# EAGLE design solenoid_final (EAGLE 9.1.3)
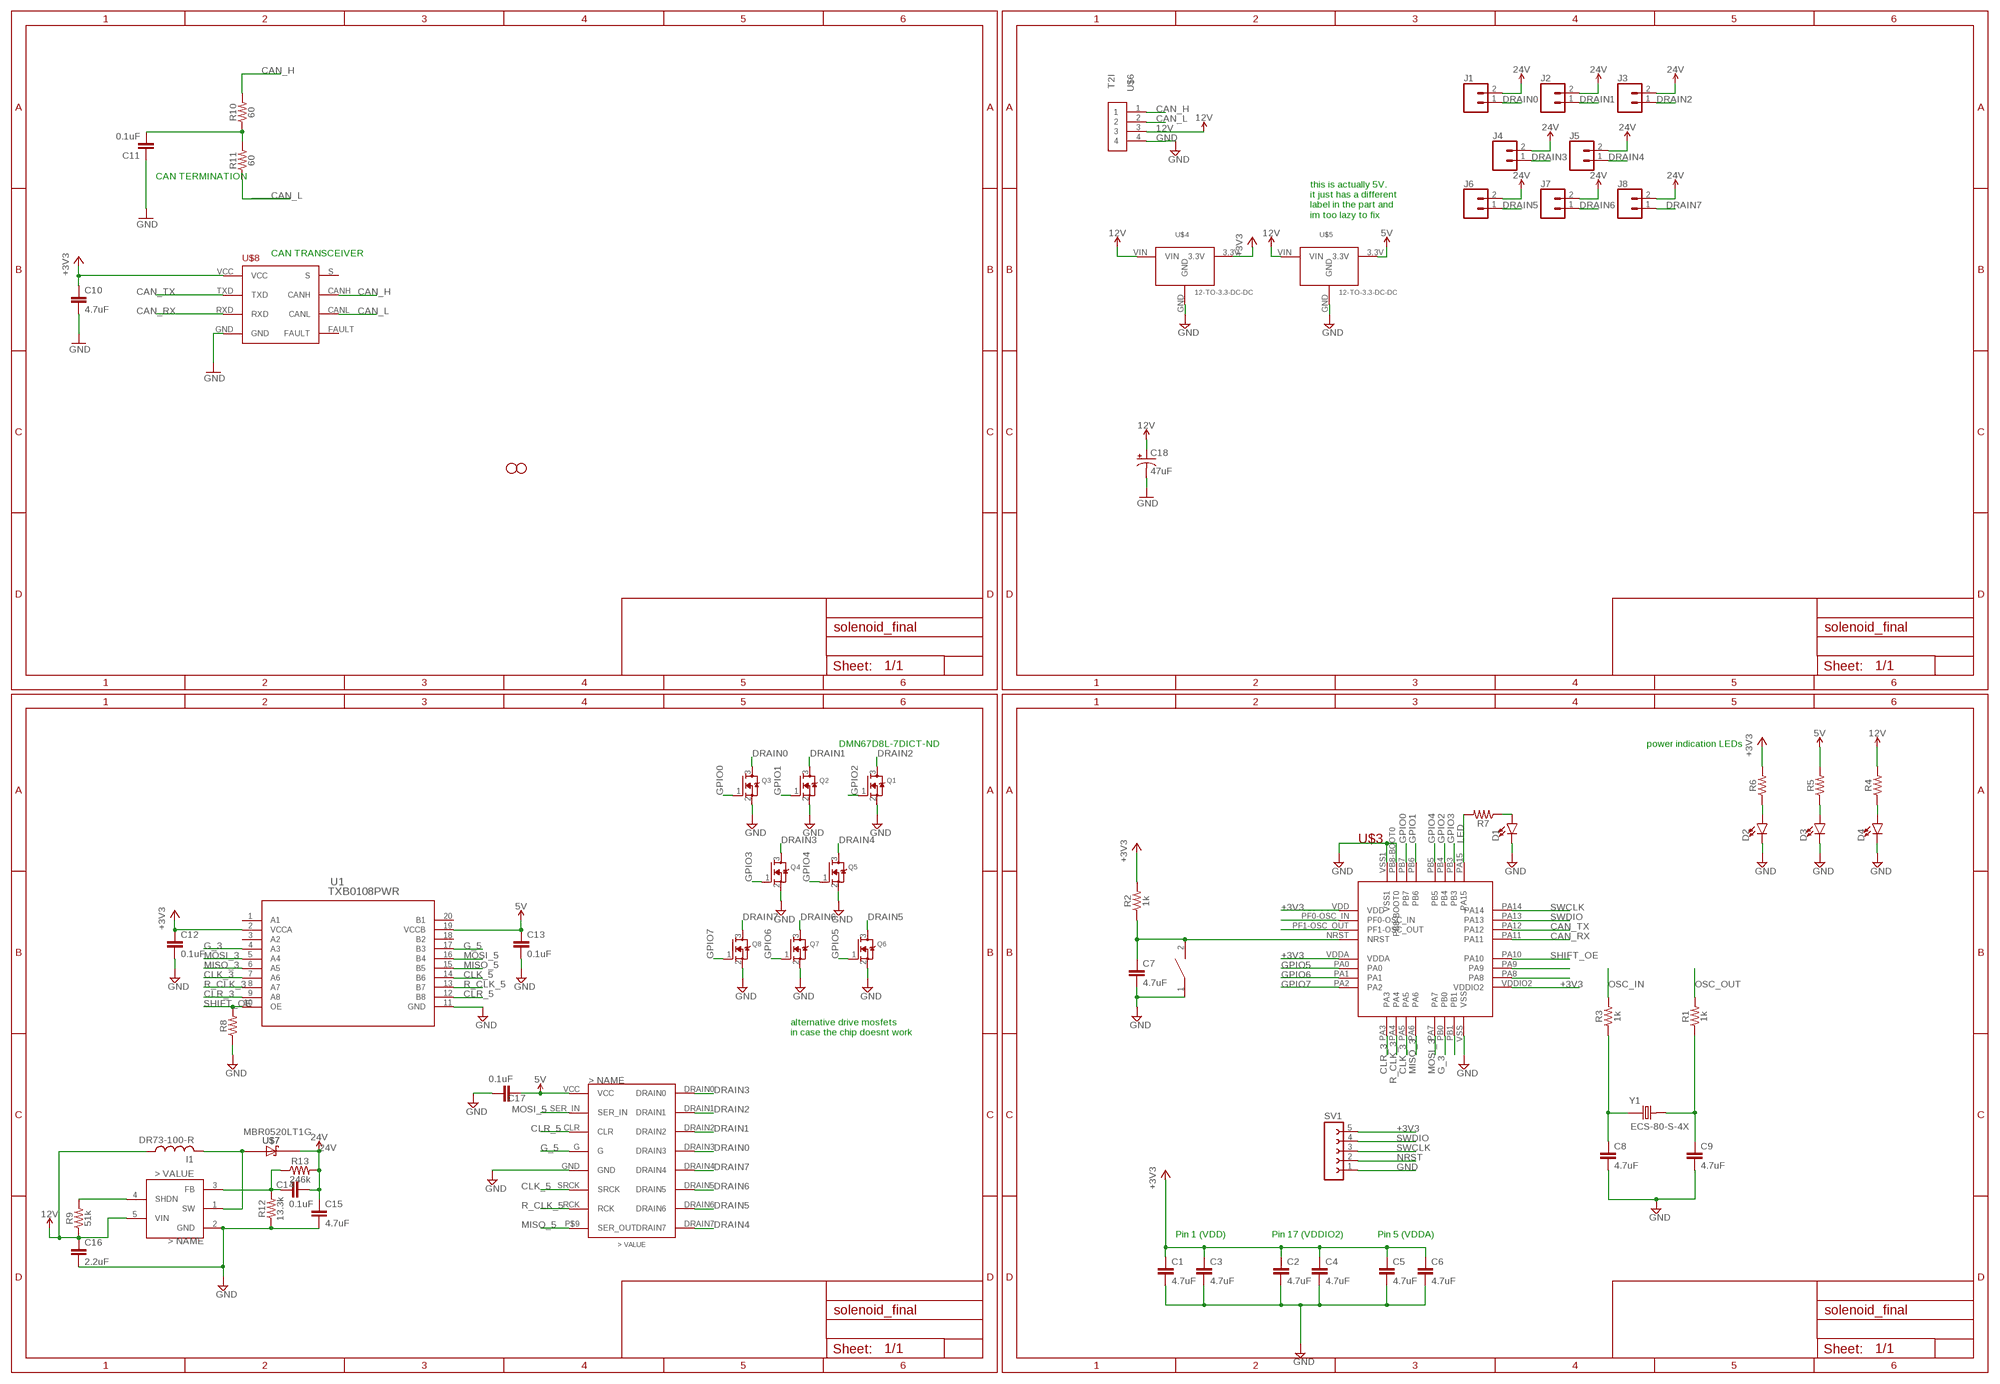
[diagram p0: schematic, sheet 1]

## Parts
C1  4.7uF  4.7UF0603  [0603]
C2  4.7uF  4.7UF0603  [0603]
C3  4.7uF  4.7UF0603  [0603]
C4  4.7uF  4.7UF0603  [0603]
C5  4.7uF  4.7UF0603  [0603]
C6  4.7uF  4.7UF0603  [0603]
C7  4.7uF  4.7UF0603  [0603]
C8  4.7uF  4.7UF0603  [0603]
C9  4.7uF  4.7UF0603  [0603]
C10  4.7uF  4.7UF0603  [0603]
C11  0.1uF  0.1UF-0603-25V-(+80/-20%)  [0603]
C12  0.1uF  0.1UF-0603-25V-5%  [0603]
C13  0.1uF  0.1UF-0603-25V-5%  [0603]
C14  0.1uF  0.1UF-0603-25V-5%  [0603]
C15  4.7uF  0.1UF-0603-25V-5%  [0603]
C16  2.2uF  0.1UF-0603-25V-5%  [0603]
C17  0.1uF  0.1UF-0603-25V-5%  [0603]
C18  47uF  47UF-POLAR-PANASONIC_D-35V-20%  [PANASONIC_D]
D1  LED0603  [LED-0603]
D2  LED0603  [LED-0603]
D3  LED0603  [LED-0603]
D4  LED0603  [LED-0603]
H1  STAND-OFF  [STAND-OFF]
H2  STAND-OFF  [STAND-OFF]
I1  DR73-100-R  [DR73-100-R]
J1  CONN_02  [1X02]
J2  CONN_02  [1X02]
J3  CONN_02  [1X02]
J4  CONN_02  [1X02]
J5  CONN_02  [1X02]
J6  CONN_02  [1X02]
J7  CONN_02  [1X02]
J8  CONN_02  [1X02]
Q1  MOSFET-NWIDE  [SOT23-WIDE]
Q2  MOSFET-NWIDE  [SOT23-WIDE]
Q3  MOSFET-NWIDE  [SOT23-WIDE]
Q4  MOSFET-NWIDE  [SOT23-WIDE]
Q5  MOSFET-NWIDE  [SOT23-WIDE]
Q6  MOSFET-NWIDE  [SOT23-WIDE]
Q7  MOSFET-NWIDE  [SOT23-WIDE]
Q8  MOSFET-NWIDE  [SOT23-WIDE]
R1  1k  1KOHM-0603-1/10W-1%  [0603]
R2  1k  1KOHM-0603-1/10W-1%  [0603]
R3  1k  1KOHM-0603-1/10W-1%  [0603]
R4  RESISTOR0603  [0603]
R5  RESISTOR0603  [0603]
R6  RESISTOR0603  [0603]
R7  RESISTOR0603  [0603]
R8  RESISTOR0603  [0603]
R9  51k  RESISTOR0603  [0603]
R10  60  1KOHM-0603-1/10W-1%  [0603]
R11  60  1KOHM-0603-1/10W-1%  [0603]
R12  13.3k  RESISTOR0603  [0603]
R13  246k  RESISTOR0603  [0603]
RESET  SWITCH  [SW_2512]
SV1  FE05-1  [FE05-1]
U1  TXB0108PWR  [PW20]
U$1  SHIFT_REGISTER  [SHIFT_REGISTER]
U$2  LM27313  [SOT95P300X145-5]
U$3  STM32F042K6T6  [STM32F042K6T6]
U$4  12-TO-3.3-DC-DC  [MURATA-DCDC]
U$5  12-TO-3.3-DC-DC  [MURATA-DCDC]
U$6  T2I  [T2I]
U$7  MBR0520LT1G  [SOD3716X135]
U$8  TCAN337D  [TCAN337D]
Y1  ECS-80-S-4X  [XTAL_ECS-80-S-4X]

## Nets
5V: C13.1 C17.1 R5.2 U1.19(VCCB) U$1.VCC U$5.3.3V
12V: C16.1 C18.+ I1.1 R4.2 R9.1 U$2.5(VIN) U$4.VIN U$5.VIN U$6.3
24V: C14.2 C15.1 J1.2 J2.2 J3.2 J4.2 J5.2 J6.2 J7.2 J8.2 R13.2 U$7.2(C)
+3V3: C1.1 C2.1 C3.1 C4.1 C5.1 C6.1 C10.1 C12.1 R2.2 R6.2 SV1.5 U1.2(VCCA) U$3.VDD U$3.VDDA U$3.VDDIO2 U$4.3.3V U$8.VCC
CAN_H: R10.2 U$6.1 U$8.CANH
CAN_L: R11.1 U$6.2 U$8.CANL
CAN_RX: U$3.PA11 U$8.RXD
CAN_TX: U$3.PA12 U$8.TXD
CLK_3: U1.7(A6) U$3.PA5
CLK_5: U1.14(B6) U$1.SRCK
CLR_3: U1.9(A8) U$3.PA3
CLR_5: U1.12(B8) U$1.CLR
DRAIN0: J1.1 Q3.3(D) U$1.DRAIN3
DRAIN1: J2.1 Q2.3(D) U$1.DRAIN2
DRAIN2: J3.1 Q1.3(D) U$1.DRAIN1
DRAIN3: J4.1 Q4.3(D) U$1.DRAIN0
DRAIN4: J5.1 Q5.3(D) U$1.DRAIN7
DRAIN5: J6.1 Q6.3(D) U$1.DRAIN6
DRAIN6: J7.1 Q7.3(D) U$1.DRAIN5
DRAIN7: J8.1 Q8.3(D) U$1.DRAIN4
G_3: U1.4(A3) U$3.PB0
G_5: U1.17(B3) U$1.G
GND: C1.2 C2.2 C3.2 C4.2 C5.2 C6.2 C7.2 C8.2 C9.2 C10.2 C11.1 C12.2 C13.2 C15.2 C16.2 C17.2 C18.- D1.C D2.C D3.C D4.C Q1.2(S) Q2.2(S) Q3.2(S) Q4.2(S) Q5.2(S) Q6.2(S) Q7.2(S) Q8.2(S) R8.1 R12.1 RESET.1 SV1.1 U1.11(GND) U$1.GND U$2.2(GND) U$3.PB8-BOOT0 U$3.VSS U$3.VSS1 U$4.GND U$5.GND U$6.4 U$8.GND
GPIO0: Q3.1(G) U$3.PB7
GPIO1: Q2.1(G) U$3.PB6
GPIO2: Q1.1(G) U$3.PB4
GPIO3: Q4.1(G) U$3.PB3
GPIO4: Q5.1(G) U$3.PB5
GPIO5: Q6.1(G) U$3.PA0
GPIO6: Q7.1(G) U$3.PA1
GPIO7: Q8.1(G) U$3.PA2
LED: R7.2 U$3.PA15
MISO_3: U1.6(A5) U$3.PA6
MISO_5: U1.15(B5) U$1.P$9(SER_OUT)
MOSI_3: U1.5(A4) U$3.PA7
MOSI_5: U1.16(B4) U$1.SER_IN
N$1: C9.1 R1.1 Y1.2
N$2: C8.1 R3.1 Y1.1
N$4: R9.2 U$2.4(SHDN)
N$5: C11.2 R10.1 R11.2
N$13: I1.2 U$2.1(SW) U$7.1(A)
N$15: C14.1 R12.2 R13.1 U$2.3(FB)
N$24: D1.A R7.1
N$25: D4.A R4.1
N$26: D3.A R5.1
N$27: D2.A R6.1
N$33: U$3.PB1
N$40: U$3.PA9
N$41: U$3.PA8
NRST: C7.1 R2.1 RESET.2 SV1.2 U$3.NRST
OSC_IN: R3.2 U$3.PF0-OSC_IN
OSC_OUT: R1.2 U$3.PF1-OSC_OUT
R_CLK_3: U1.8(A7) U$3.PA4
R_CLK_5: U1.13(B7) U$1.RCK
SHIFT_OE: R8.2 U1.10(OE) U$3.PA10
SWCLK: SV1.3 U$3.PA14
SWDIO: SV1.4 U$3.PA13
Unconnected: U1.1(A1) U1.3(A2) U1.18(B2) U1.20(B1) U$8.FAULT U$8.S

## Notes on the sheet
- CAN TERMINATION
- this is actually 5V. 
  it just has a different 
  label in the part and 
  im too lazy to fix
- CAN TRANSCEIVER
- DMN67D8L-7DICT-ND | power indication LEDs
- alternative drive mosfets 
  in case the chip doesnt work
- Pin 1 (VDD) | Pin 17 (VDDIO2) | Pin 5 (VDDA)

## Library data of the parts
C1-C10 = SparkFun-Capacitors:4.7UF: 4.7µF ceramic capacitors A capacitor is a passive two-terminal electrical component used to store electrical energy temporarily in an electric field.; PROD_ID: CAP-08280
C11 = SparkFun-Capacitors:0.1UF: 0.1µF ceramic capacitors A capacitor is a passive two-terminal electrical component used to store electrical energy temporarily in an electric field.; PROD_ID: CAP-00810
C12-C14 C17 = SparkFun-Capacitors:0.1UF: 0.1µF ceramic capacitors A capacitor is a passive two-terminal electrical component used to store electrical energy temporarily in an electric field.; PROD_ID: CAP-08604
C15 C16 = SparkFun-Capacitors:0.1UF: 0.1µF ceramic capacitors A capacitor is a passive two-terminal electrical component used to store electrical energy temporarily in an electric field.; PROD_ID: CAP-08604; VALUE: 0.1uF
C18 = SparkFun-Capacitors:47UF-POLAR: 47µF polarized capacitors A capacitor is a passive two-terminal electrical component used to store electrical energy temporarily in an electric field.; PROD_ID: CAP-08478
D1-D4 = SparkFun-LED:LED: LED (Generic) Standard schematic elements and footprints for 5mm, 3mm, 1206, and 0603 sized LEDs. Generic LEDs with no color specified.
H1 H2 = SparkFun-Hardware:STAND-OFF: Stand Off Drill holes for mechanically mounting via screws, standoffs, etc. Note: Use the keepout ring to avoid running the screw head into surrounding components. Variant Overviews STAND-OFF - Mechanical footprint for a #4 phillips button head screw. STAND-OFF-TIGHT - Mechanical footprint for a #4 phillips button head screw, Example SparkFun Products Screw - Phillips Head (1/4", 4-40, 10 pack) <https://www.sparkfun.com/products/10453> (PRT-10453) Screw - Phillips Head (1/2", 4-40, 10 pack) <https://www.sparkfun.com/products/10452> (PRT-10452) Screw - Phillips Head (3/4", 4-40, 10 pack) <https://www.sparkfun.com/products/10451> (PRT-10451) Screw - Phillips Head (1", 4-40, 10 pack) <https://www.sparkfun.com/products/10450> (PRT-10450)
I1 = Solenoid_parts:DR73-100-R
J1-J8 = SparkFun-Connectors:CONN_02: Multi connection point. Often used as Generic Header-pin footprint for 0.1 inch spaced/style header connections On any of the 0.1 inch spaced packages, you can populate with these: Break Away Headers - Straight <https://www.sparkfun.com/products/116> (PRT-00116) Break Away Male Headers - Right Angle <https://www.sparkfun.com/products/553> (PRT-00553) Female Headers <https://www.sparkfun.com/products/115> (PRT-00115) Break Away Headers - Machine Pin <https://www.sparkfun.com/products/117> (PRT-00117) Break Away Female Headers - Swiss Machine Pin <https://www.sparkfun.com/products/743> (PRT-00743) For SCREWTERMINALS and SPRING TERMINALS visit here: Screw Terimnals on SparkFun.com <https://www.sparkfun.com/search/results?term=Screw+Terminals> (5mm/3.5mm/2.54mm spacing) This device is also useful as a general connection point to wire up your design to another part of your project. Our various solder wires solder well into these plated through hole pads. Hook-Up Wire - Assortment (Stranded, 22 AWG) <https://www.sparkfun.com/products/11375> (PRT-11375) Hook-Up Wire - Assortment (Solid Core, 22 AWG) <https://www.sparkfun.com/products/11367> (PRT-11367) View the entire wire category on our website here <https://www.sparkfun.com/categories/141> Special notes: Molex polarized connector foot print use with: PRT-08233 with associated crimp pins and housings. 2.54_SCREWTERM for use with PRT-10571. 3.5mm Screw Terminal footprints for PRT-08084 5mm Screw Terminal footprints for use with PRT-08432
Q1-Q8 = microbuilder:MOSFET-N: N-Channel Mosfet LEGEND VDS: Voltage Drain-Source ID: Drain Current RDS(ON): Drain-Source On-State Resistance VGS(TH): Gate-Source Threshold Voltage CISS: Drain-Source Input Capacitance SOT-23 Name VDS ID RDS(ON) VGS(TH) CISS Order Number 2N7002E 60V 260mA 2.5 Ohm 2.5V @ 250uA 26.7pF @ 25V 2N7002ET1GOSTR-ND BSH103 30V 850mA 400 mOhm 400mV @ 1mA 83pF @ 24V BSH103,235-ND BSS138 60V 320mA 1.6 Ohm 1.5V @ 250uA 50pF @ 10V Mouser: 771-BSS138PW115 DMN2075U-7 20V 4.2A 38 mOhm 1V @ 250 uA 594.3pF @ 10V DMN2075U-7DICT-ND * BSS138 good choice for I2C level-shifting
R1-R3 = SparkFun-Resistors:1KOHM: 1kΩ resistor A resistor is a passive two-terminal electrical component that implements electrical resistance as a circuit element. Resistors act to reduce current flow, and, at the same time, act to lower voltage levels within circuits. - Wikipedia; PROD_ID: RES-07856
R4-R9 R12 R13 = SparkFun-Resistors:RESISTOR: Generic Resistor Package
R10 R11 = SparkFun-Resistors:1KOHM: 1kΩ resistor A resistor is a passive two-terminal electrical component that implements electrical resistance as a circuit element. Resistors act to reduce current flow, and, at the same time, act to lower voltage levels within circuits. - Wikipedia; PROD_ID: RES-07856; VALUE: 1k
RESET = DiscreteComponents:SWITCH
SV1 = con-lsta:FE05-1: FEMALE HEADER; OC_FARNELL: unknown; OC_NEWARK: unknown
U1 = ece477:TXB0108PWR; MANUFACTURER_PART_NUMBER: TXB0108PWR; VENDOR: Texas Instruments
U$1 = Solenoid_parts:SHIFT_REGISTER
U$2 = Solenoid_parts:LM27313
U$3 = PI_Shield_Library:STM32F042K6T6
U$4 U$5 = ece477:12-TO-3.3-DC-DC
U$6 = BackplaneParts:T2I
U$7 = Solenoid_parts:MBR0520LT1G: Surface Mount Schottky Power Rectifier Plastic SOD−123 Package
U$8 = PI_Shield_Library:TCAN337D
Y1 = ECS-80-S-4X:ECS-80-S-4X: CRYSTAL T/H; DESCRIPTION: Crystal 8MHz Series 2-Pin HC-49/U; DIGI-KEY_PART_NUMBER: X1057-ND; DIGI-KEY_PURCHASE_URL: https://www.digikey.com/product-detail/en/ecs-inc/ECS-80-S-4X/X1057-ND/827549?utm_source=snapeda&utm_medium=aggregator&utm_campaign=symbol; MF: ECS International; MP: ECS-80-S-4X; PACKAGE: HC-49/US ECS International

## Board
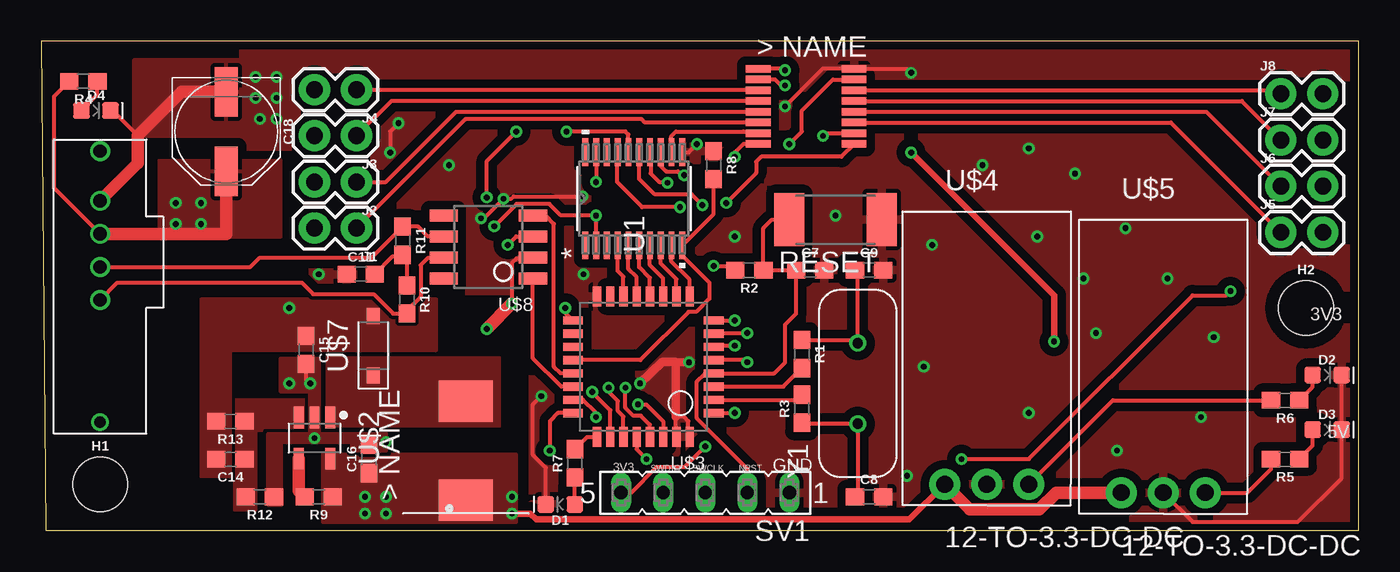
[diagram p1: board, top side]
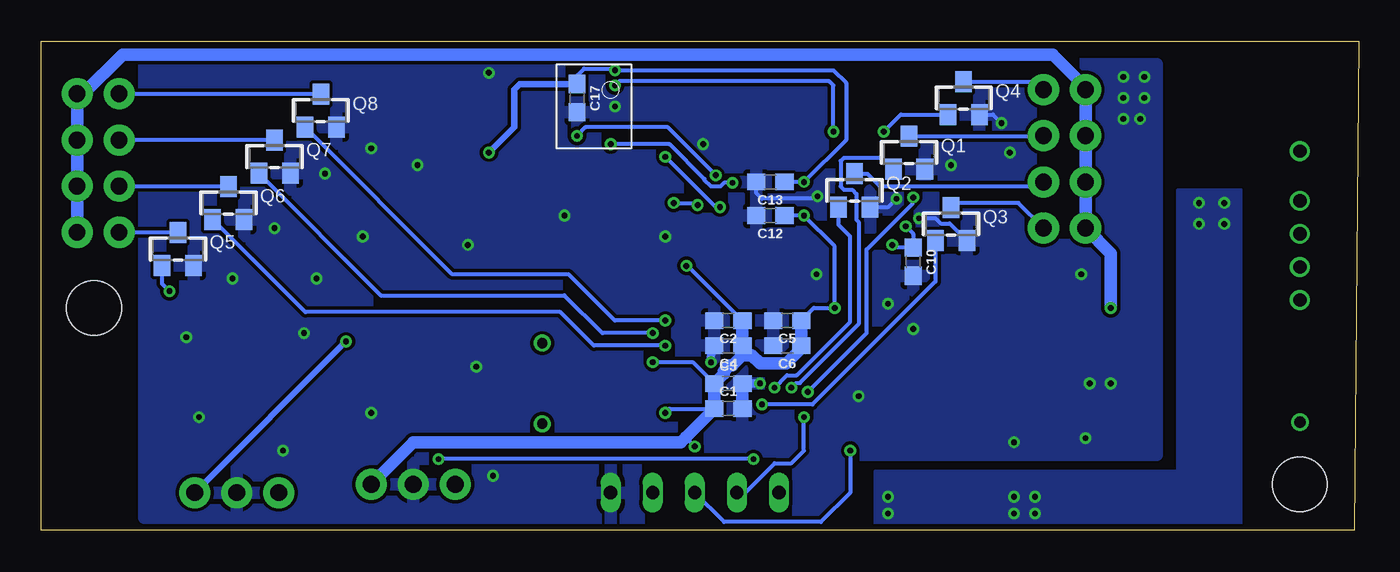
[diagram p2: board, bottom side, seen from below]

Size 79.63 x 29.59 mm. Coordinates in mm from the lower left corner, seen from the top.
Outline: 0.25,0 79.63,0 79.63,29.59 0,29.59 0.25,0
Copper layers (1*16): Top 0.0356mm / dielectric 1.5011mm / Bottom 0.0356mm
Design rules "ECE_Senior_Design": minimum track width 8mil, minimum drill 13mil, track to track 8mil, track to pad 8mil, pad to pad 6mil, via to via 8mil, smd to smd 6mil, copper to edge 15mil, drill to drill 8mil, minimum pad ring 7mil, minimum via ring 7mil, stop-mask expansion 3mil, vias tented up to drill 0mil, thermal gap 10mil

### Footprints (pad centres in the part's own frame; a part is rotated, then mirrored left to right if it is on the bottom)
0603 = smd 1.1 x 1: 1 -0.85,0; 2 0.85,0
PANASONIC_D = smd 3 x 1.4: + 2.4,0; - -2.4,0
LED-0603 = smd 1 x 1: A -0.877,0; C 0.877,0
STAND-OFF = hole 3.302: 0,0
DR73-100-R = smd 2.5 x 3.25: 1 -3,0; 2 3,0
1X02 = drill 1.016 pad 1.88: 1 0,0; 2 2.54,0
SOT23-WIDE = smd 1 x 1.27: 1 -0.95,-1; 2 0.95,-1; 3 0,1
SW_2512 = smd 1.8 x 3.2: 1 -2.8,0; 2 2.8,0
FE05-1 = drill 0.813 long: 1 -5.08,0; 2 -2.54,0; 3 0,0; 4 2.54,0; 5 5.08,0
PW20 = smd 1.676 x 0.356: 1 -2.819,2.925; 2 -2.819,2.275; 3 -2.819,1.625; 4 -2.819,0.975; 5 -2.819,0.325; 6 -2.819,-0.325; 7 -2.819,-0.975; 8 -2.819,-1.625; 9 -2.819,-2.275; 10 -2.819,-2.925; 11 2.819,-2.925; 12 2.819,-2.275; 13 2.819,-1.625; 14 2.819,-0.975; 15 2.819,-0.325; 16 2.819,0.325; 17 2.819,0.975; 18 2.819,1.625; 19 2.819,2.275; 20 2.819,2.925
SHIFT_REGISTER = smd 1.5 x 0.45: CLR -2.9,-1.625; DRAIN0 -2.9,0.975; DRAIN1 -2.9,0.325; DRAIN2 -2.9,-0.325; DRAIN3 -2.9,-0.975; DRAIN4 2.9,0.975; DRAIN5 2.9,0.325; DRAIN6 2.9,-0.325; DRAIN7 2.9,-0.975; G -2.9,-2.275; GND 2.9,2.275; P$9 2.9,-2.275; RCK 2.9,-1.625; SER_IN -2.9,1.625; SRCK 2.9,1.625; VCC -2.9,2.275
SOT95P300X145-5 = smd 1.319 x 0.589: 1 -1.246,0.95; 2 -1.246,0; 3 -1.246,-0.95; 4 1.246,-0.95; 5 1.246,0.95
STM32F042K6T6 = smd 1.2 x 0.5: NRST 0,3.2; PA0 0,1.6; PA1 0,0.8; PA2 0,0; PA8 8.5,0.8; PA9 8.5,1.6; PA10 8.5,2.4; PA11 8.5,3.2; PA12 8.5,4; PA13 8.5,4.8; PA14 8.5,5.6; PF0-OSC_IN 0,4.8; PF1-OSC_OUT 0,4; VDD 0,5.6; VDDA 0,2.4; VDDIO2 8.5,0 | smd 0.5 x 1.2: PA3 1.45,-1.45; PA4 2.25,-1.45; PA5 3.05,-1.45; PA6 3.85,-1.45; PA7 4.65,-1.45; PA15 7.05,7.05; PB0 5.45,-1.45; PB1 6.25,-1.45; PB3 6.25,7.05; PB4 5.45,7.05; PB5 4.65,7.05; PB6 3.85,7.05; PB7 3.05,7.05; PB8-BOOT0 2.25,7.05; VSS 7.05,-1.45; VSS1 1.45,7.05
MURATA-DCDC = drill 1.016 pad 1.88: 3.3V 2.54,0; GND 0,0; VIN -2.54,0
T2I = drill 0.8: 1 8.1,2.8; 2 10.1,2.8; 3 12.1,2.8; 4 14.1,2.8; S2 17.1,2.8 | drill 0.7: S1 0.7,2.8
SOD3716X135 = smd 0.977 x 0.789: 1 -1.796,0; 2 1.796,0
TCAN337D = smd 1.7 x 0.75: CANH 5.4,2.54; CANL 5.4,1.27; FAULT 5.4,0; GND 0,2.54; RXD 0,0; S 5.4,3.81; TXD 0,3.81; VCC 0,1.27
XTAL_ECS-80-S-4X = drill 0.63 pad 1.03: 1 -2.44,0; 2 2.44,0

### Placement (x,y rotation side)
C1  38.1,7.37 0 bottom
C2  38.1,12.7 180 bottom
C3  38.1,8.89 0 bottom
C4  38.1,11.18 180 bottom
C5  34.54,12.7 180 bottom
C6  34.54,11.18 180 bottom
C7  46.48,15.75 0 top
C8  50.04,2.03 0 top
C9  50.04,15.75 0 top
C10  26.92,16.26 270 bottom
C11  19.3,15.49 0 top
C12  35.56,19.05 180 bottom
C13  35.56,21.08 180 bottom
C14  11.43,4.32 180 top
C15  16,10.92 270 top
C16  19.81,4.32 90 top
C17  47.24,26.16 270 bottom
C18  11.18,24.13 270 top
D1  31.37,1.57 180 top
D2  77.72,9.4 0 top
D3  77.72,6.1 0 top
D4  3.3,25.4 0 top
H1  3.56,2.79 0 top
H2  76.45,13.46 0 top
I1  25.65,4.83 90 top
J1  19.05,18.29 180 top
J2  19.05,21.08 180 top
J3  19.05,23.88 180 top
J4  19.05,26.67 180 top
J5  74.93,18.03 0 top
J6  74.93,20.83 0 top
J7  74.93,23.62 0 top
J8  74.93,26.42 0 top
Q1  27.18,22.86 0 bottom
Q2  30.48,20.57 0 bottom
Q3  24.64,18.54 0 bottom
Q4  23.88,26.16 0 bottom
Q5  71.37,17.02 0 bottom
Q6  68.33,19.81 0 bottom
Q7  65.53,22.61 0 bottom
Q8  62.74,25.4 0 bottom
R1  45.97,10.67 270 top
R2  42.8,15.75 180 top
R3  45.97,7.37 90 top
R4  2.54,27.18 180 top
R5  75.18,4.32 180 top
R6  75.18,7.87 180 top
R7  32.26,4.06 90 top
R8  40.64,22.1 270 top
R9  16.76,2.03 180 top
R10  22.1,13.97 270 top
R11  21.84,17.53 270 top
R12  13.21,2.03 180 top
R13  11.43,6.6 180 top
RESET  48.01,18.8 180 top
SV1  40.13,2.29 180 top
U1  35.81,20.07 90 top
U$1  46.23,25.65 0 top
U$2  16.51,5.59 270 top
U$3  40.64,12.7 180 top
U$4  57.15,2.79 0 top
U$5  67.82,2.29 0 top
U$6  6.35,5.84 90 top
U$7  20.07,11.18 90 top
U$8  29.72,19.05 180 top
Y1  49.35,8.89 90 top

### Tracks (layer width: path | path; a pad name or v marks a point on that pad's centre or on a via)
5V  (via drill 0.35)
  Top 0.254: U1.19 33.54,21.09 v33.53,21.08 | v44.96,27.84 44.87,27.93 U$1.VCC | U$5.3.3V 72.9,2.29 74.33,3.72 R5.2
  Top 0.406: v52.58,22.86 61.21,14.22 v61.21,11.43
  Bottom 0.254: C13.1 v33.53,21.08 30.99,23.62 30.99,27.08 31.75,27.84 34.8,27.84 v44.96,27.84 45.06,27.94 46.82,27.94 47.24,27.52 47.24,27.18 C17.1
  Bottom 0.406: U$5.3.3V v61.21,11.43 | C17.1 50.71,27.01 51.05,26.67 51.05,24.38 v52.58,22.86
12V  (via drill 0.35)
  Top 0.254: R4.2 0.76,26.25 0.76,20.73 U$6.3
  Top 0.406: v28.45,1.02 29.56,1.02 29.92,0.66 52.48,0.66 U$4.VIN
  Top 0.762: U$6.3 11.18,17.94 C18.+ | U$5.VIN 61.34,2.29 60.32,1.27 56.13,1.27 U$4.VIN
  other vias: 28.45,2.03 20.83,2.03 19.56,2.03 19.56,1.02 20.83,1.02 8.13,19.81 9.65,19.81 9.65,18.54 8.13,18.54
  pour Top (rank 2, no thermals): 17.02,4.57 17.02,0.51 28.7,0.51 28.7,4.57
  pour Bottom: 29.21,3.56 29.21,0.25 7.11,0.25 7.11,20.57 7.87,20.57 10.92,20.57 10.92,5.08 10.92,3.56
  pour Top: 7.11,22.35 7.11,17.78 14.48,17.78 14.48,22.35
24V  (via drill 0.35)
  Bottom 0.762: J5.2 J6.2 J7.2 J8.2 77.09,26.42 74.72,28.78 18.5,28.78 16.51,26.79 J4.2 J3.2 J2.2 J1.2 14.99,16.76 v14.99,13.46
  pour Top (no thermals): 23.88,13.97 9.65,13.97 9.65,3.3 11.43,3.3 11.43,10.92 23.88,10.92
+3V3  (via drill 0.35)
  Top 0.254: U1.2 33.54,19.04 v33.53,19.05 31.41,19.05 30.71,19.75 29.46,19.75 28.73,19.75 v27.37,18.4 | U$4.3.3V 64.77,7.87 R6.2 | U$3.VDD 40.65,7.11 v41.91,7.11 | v42.67,10.18 42.55,10.3 U$3.VDDA | v31.67,13.46 31.67,13.17 U$3.VDDIO2 | SV1.5 35.65,2.29 37.2,3.83 38.89,3.83 v40.13,5.08 | v28.19,17.27 28.7,17.78 U$8.VCC | v40.64,16 41.7,16 R2.2
  Bottom 0.254: C12.1 v33.53,19.05 31.67,17.19 v31.67,13.46 32.93,13.46 C5.1 | v41.91,7.11 41.66,7.37 C1.1 | C3.1 40.22,10.16 42.65,10.16 v42.67,10.18 | v40.13,5.08 40.68,5.63 | v27.37,18.4 26.92,17.95 C10.1 28.03,17.11 v28.19,17.27 | C2.1 40.55,16 v40.64,16
  Bottom 0.762: U$4.3.3V 57.15,5.33 40.98,5.33 40.68,5.63 C1.1 C3.1 38.38,9.46 38.38,9.63 38.04,9.97 37.87,9.97 37.25,10.59 | 37.25,10.59 C4.1 C2.1 | 37.25,10.59 36.68,10.59 36.19,10.09 34.6,10.09 33.69,11 C6.1 C5.1
CAN_H
  Top 0.254: U$6.1 4.59,14.99 15.75,14.99 16.44,14.3 20.09,14.3 21.27,13.12 R10.2 22.1,13.3 22.93,14.13 22.93,16.05 23.39,16.51 U$8.CANH
CAN_L
  Top 0.254: U$6.2 12.64,15.94 13.21,16.51 19.98,16.51 R11.1 22.77,18.38 23.37,17.78 U$8.CANL
CAN_RX
  Top 0.254: U$3.PA11 31.39,9.5 30.99,9.91 30.99,18.54 30.48,19.05 U$8.RXD
CAN_TX
  Top 0.254: U$3.PA12 31.43,8.7 29.72,10.41 U$8.TXD
CLK_3
  Top 0.254: U$3.PA5 37.59,15.24 36.79,16.04 U1.7
CLK_5  (via drill 0.35)
  Top 0.254: U$1.SRCK 47.85,27.28 45.97,25.4 45.97,24.13 v45.21,23.37 | U1.14 36.83,22.84 36.83,21.59 37.34,21.08 37.59,21.08 37.64,21.03 v37.85,21.03
  Bottom 0.254: v37.85,21.03 38.35,21.03 38.58,20.81 39.14,20.81 39.54,21.21 39.54,21.26 41.66,23.37 v45.21,23.37
CLR_3
  Top 0.254: U$3.PA3 39.19,15.17 38.09,16.27 U1.9
CLR_5
  Top 0.254: U1.12 38.09,23.86 38.35,24.13 42.43,24.13 42.44,24.12 43.23,24.12 U$1.CLR
DRAIN0
  Top 0.254: U$1.DRAIN3 36.48,24.68 36.29,24.87 25.63,24.87 J1.1
  Bottom 0.254: J1.1 20.57,19.81 24.37,19.81 Q3.3
DRAIN1
  Top 0.254: U$1.DRAIN2 25.08,25.33 20.83,21.08 J2.1
  Bottom 0.254: Q2.3 29.7,21.57 28.96,20.83 19.3,20.83 J2.1
DRAIN2
  Top 0.254: U$1.DRAIN1 21.15,25.98 J3.1
  Bottom 0.254: Q1.3 19.07,23.86 J3.1
DRAIN3
  Top 0.254: U$1.DRAIN0 19.09,26.63 J4.1
  Bottom 0.254: Q4.3 19.54,27.16 J4.1
DRAIN4
  Top 0.254: U$1.DRAIN7 68.29,24.68 J5.1
  Bottom 0.254: Q5.3 74.91,18.02 J5.1
DRAIN5
  Top 0.254: U$1.DRAIN6 70.43,25.33 J6.1
  Bottom 0.254: Q6.3 74.91,20.81 J6.1
DRAIN6
  Top 0.254: U$1.DRAIN5 72.57,25.98 J7.1
  Bottom 0.254: Q7.3 74.91,23.61 J7.1
DRAIN7
  Top 0.254: U$1.DRAIN4 74.72,26.63 J8.1
  Bottom 0.254: Q8.3 74.91,26.4 J8.1
G_3
  Top 0.254: U$3.PB0 35.19,15.36 34.84,15.71 U1.4
G_5  (via drill 0.35)
  Top 0.254: U$1.G 42.43,23.38 41.91,22.86 v41.91,22.61 | v38.61,19.56 36.32,19.56 34.8,21.08 34.8,22.84 U1.17
  Bottom 0.254: v41.91,22.61 38.73,19.43 v38.61,19.56
GND  (via drill 0.35)
  Top 0.254: v16.26,8.89 16,9.14 C15.2 | 5.84,23.88 4.32,25.4 D4.C | D2.C D3.C 78.6,3.16 75.95,0.51 69.6,0.51 U$5.GND | U$8.GND 29.66,16.45 28.73,16.45 28.45,16.17 v28.45,13.72 | v21.59,24.64 21.08,24.13 v21.08,22.86 | v32.71,20.21 28.54,20.21 28.39,20.07 v27.94,20.07 26.76,18.89 v26.58,18.89 | U$3.PB8-BOOT0 38.35,5.69 38.35,6.86 38.86,6.86 39.12,6.6 39.12,5.72 U$3.VSS1 | v52.58,27.69 52.34,27.93 U$1.GND 47.23,27.93 v44.96,25.65 | D1.C 30.49,3.8 29.72,4.57 29.72,7.62 v30.23,8.13 | U1.11 39.14,22.89 v39.62,23.37
  Top 0.508: v39.15,10.17 38.35,10.18 | 38.35,10.18 37.52,10.19 v36.18,8.89 | 38.35,6.86 38.35,10.18 | 38.35,10.18
  Top 0.762: U$6.4 5.84,22.23 5.84,23.88 8.5,26.53 C18.- | v28.45,13.72 v26.92,12.19
  Bottom 0.254: Q4.2 22.11,25.16 v21.59,24.64 | C13.2 36.41,20.41 36.07,20.07 32.86,20.07 v32.71,20.21 | Q2.2 28.43,19.57 v27.94,20.07 | Q3.2 24.72,18.58 25.28,18.58 25.59,18.89 v26.58,18.89
  Bottom 0.508: C4.2 39.15,10.98 v39.15,10.17 | v36.18,8.89 C3.2
  Bottom 0.762: C3.2 C1.2
  other vias: 14.99,8.89 16.51,5.59 20.83,5.33 12.95,27.43 14.22,27.43 14.22,26.16 12.95,26.16 14.22,24.89 13.21,24.89 56.9,22.1 59.69,23.11 62.48,21.59 60.2,17.78 62.99,15.24 65.53,18.29 68.07,15.24 63.75,11.94 70.87,11.68 70.1,6.86 65.02,4.83 59.69,7.11 53.34,9.91 52.32,3.3 16.76,15.49 32.77,15.49 24.64,22.1 53.85,17.27 48.01,19.05 41.91,17.78
  pour Top (no thermals): 14.48,10.41 16.76,10.41 16.76,7.87 16.76,5.84 20.83,5.84 20.83,5.33 20.83,4.83 18.8,4.83 18.8,5.33 16.76,5.33 14.48,5.33 14.48,1.52 13.72,1.52 13.72,5.84 16.26,5.84 16.26,8.38 14.48,8.38
  pour Bottom: 12.19,28.19 12.19,4.57 30.23,4.57 30.23,0.76 73.41,0.76 73.41,28.19
  pour Top: 5.59,28.45 5.59,23.88 14.99,23.88 14.99,28.45
  pour Top (isolate 0.508, rank 2): 12.19,29.97 79.5,29.97 79.5,0 29.72,0 29.72,14.48 12.19,14.48
GPIO0  (via drill 0.35)
  Top 0.254: v36.07,7.62 36.58,7.62 37.59,6.6 U$3.PB7
  Bottom 0.254: Q3.1 25.59,15.05 33.02,7.62 v36.07,7.62
GPIO1  (via drill 0.35)
  Top 0.254: U$3.PB6 36.79,6.39 36.24,6.94 35.78,6.94 35.31,7.42 v35.31,8.64
  Bottom 0.254: v35.31,8.64 34.56,9.38 33.97,9.38 30.73,12.62 30.73,17.78 31.43,18.48 Q2.1
GPIO2  (via drill 0.35)
  Top 0.254: U$3.PB4 35.19,6.89 34.85,7.23 34.85,7.82 34.29,8.38 v34.29,8.64
  Bottom 0.254: v34.29,8.64 34,8.92 33.78,8.92 30.26,12.45 | 30.26,12.45 | 30.26,12.45 30.23,12.48 30.23,18.67 30.36,18.8 30.36,20.36 30.61,20.61 31.12,20.61 31.31,20.8 31.31,22.35 31.12,22.54 28.94,22.54 28.87,22.61 Q1.1
GPIO3  (via drill 0.35)
  Top 0.254: U$3.PB3 34.39,7.27 33.27,8.38 v33.3,8.38 | v26.92,20.14 26.92,22.35 v28.7,24.13
  Bottom 0.254: v26.92,20.14 26.92,19.81 29.74,17 29.74,11.94 v33.3,8.38 | v28.7,24.13 27.67,25.16 Q4.1
GPIO4  (via drill 0.35)
  Top 0.254: U$3.PB5 35.99,4.9 v36.58,4.32 | v55.63,4.32 59.69,4.32 69.6,14.22 71.63,14.22 v71.88,14.48
  Bottom 0.254: v71.88,14.48 72.32,14.92 Q5.1 | v36.58,4.32 v55.63,4.32
GPIO5  (via drill 0.35)
  Top 0.254: U$3.PA0 40.72,11.18 v41.91,11.18
  Bottom 0.254: v41.91,11.18 46.23,11.18 48.26,13.21 63.67,13.21 Q6.1
GPIO6  (via drill 0.35)
  Top 0.254: U$3.PA1 40.68,11.94 v42.67,11.94
  Bottom 0.254: v42.67,11.94 45.72,11.94 48.01,14.22 59.1,14.22 Q7.1
GPIO7  (via drill 0.35)
  Top 0.254: U$3.PA2 v41.91,12.7
  Bottom 0.254: v41.91,12.7 44.96,12.7 47.75,15.49 54.78,15.49 Q8.1
LED
  Top 0.254: R7.2 32.99,5.65 U$3.PA15
MISO_3
  Top 0.254: U$3.PA6 36.79,15.28 36.14,15.93 U1.6
MISO_5  (via drill 0.35)
  Top 0.254: U$1.P$9 48.35,22.61 43.51,22.61 43.21,22.31 43.21,21.62 v41.4,19.81 | v39.96,19.69 39.32,20.32 37.08,20.32 36.14,21.27 U1.15
  Bottom 0.254: v41.4,19.81 40.13,19.81 40.01,19.69 v39.96,19.69
MOSI_3
  Top 0.254: U$3.PA7 35.99,15.32 35.49,15.82 U1.5
MOSI_5  (via drill 0.35)
  Top 0.254: U$1.SER_IN 44.35,27.28 44.47,27.15 44.7,26.92 v44.96,26.92 | U1.16 35.49,23.95 35.31,24.13 v31.75,24.13
  Bottom 0.254: v44.96,26.92 44.7,27.18 32,27.18 31.75,26.92 v31.75,24.13
N$1
  Top 0.254: R1.1 49.16,11.52 Y1.2 49.35,15.58 C9.1
N$2
  Top 0.254: R3.1 46.04,6.45 Y1.1 49.35,2.2 C8.1
N$4
  Top 0.762: R9.2 15.56,2.39 U$2.4
N$5
  Top 0.254: R11.2 21.93,16.59 | 21.93,16.59 22.1,16.42 R10.1 | C11.2 21.25,16.59 21.93,16.59
N$13
  pour Top (no thermals): 17.27,10.41 17.27,6.35 27.69,6.35 27.69,10.41
N$15
  pour Top (rank 2, no thermals): 16,7.87 11.68,7.87 11.68,1.27 12.95,1.27 12.95,6.1 16,6.1
N$24
  Top 0.254: D1.A 32.26,1.59 R7.1
N$25
  Top 0.254: D4.A 3.39,26.36 R4.1
N$26
  Top 0.254: R5.1 76.85,5.13 D3.A
N$27
  Top 0.254: R6.1 76.85,8.69 D2.A
NRST
  Top 0.254: SV1.2 42.67,3.73 39.62,6.78 39.62,9 40.12,9.5 U$3.NRST 44.3,9.5 44.96,10.16 44.96,12.45 45.63,13.12 C7.1 R2.1 43.65,18.29 44.16,18.8 RESET.2
OSC_IN
  Top 0.254: U$3.PF0-OSC_IN 45.66,7.9 R3.2
OSC_OUT
  Top 0.254: U$3.PF1-OSC_OUT 44.86,8.7 R1.2
R_CLK_3
  Top 0.254: U$3.PA4 38.39,15.2 37.44,16.16 U1.8
R_CLK_5  (via drill 0.35)
  Top 0.254: v47.24,23.88 47.4,24.03 U$1.RCK | U1.13 37.44,22.05 37.77,21.72 38.48,21.72 38.71,21.49 v38.86,21.49
  Bottom 0.254: v38.86,21.49 41.75,24.38 46.74,24.38 v47.24,23.88
SHIFT_OE
  Top 0.254: R8.2 40.64,19.15 U1.10 38.74,16.63 40.39,14.99 40.39,14.03 39.58,13.22 39.13,13.22 36.21,10.3 U$3.PA10
SWCLK  (via drill 0.35)
  Top 0.254: U$3.PA14 31.23,7.1 30.73,6.6 v30.73,4.83
  Bottom 0.254: v30.73,4.83 30.73,2.29 32.51,0.51 38.35,0.51 SV1.3
SWDIO  (via drill 0.35)
  Top 0.254: U$3.PA13 32.74,7.9 33.53,7.11 v33.53,6.86
  Bottom 0.254: v33.53,6.86 33.53,4.83 34.29,4.06 35.31,4.06 37.08,2.29 SV1.4

### Text on the board
tPlace: 3V3 | 5V | 3V3 | SWDIO | SWCLK | NRST | GND